# Altium schematic sheet 0175_virtual battery.SchDoc
size A3
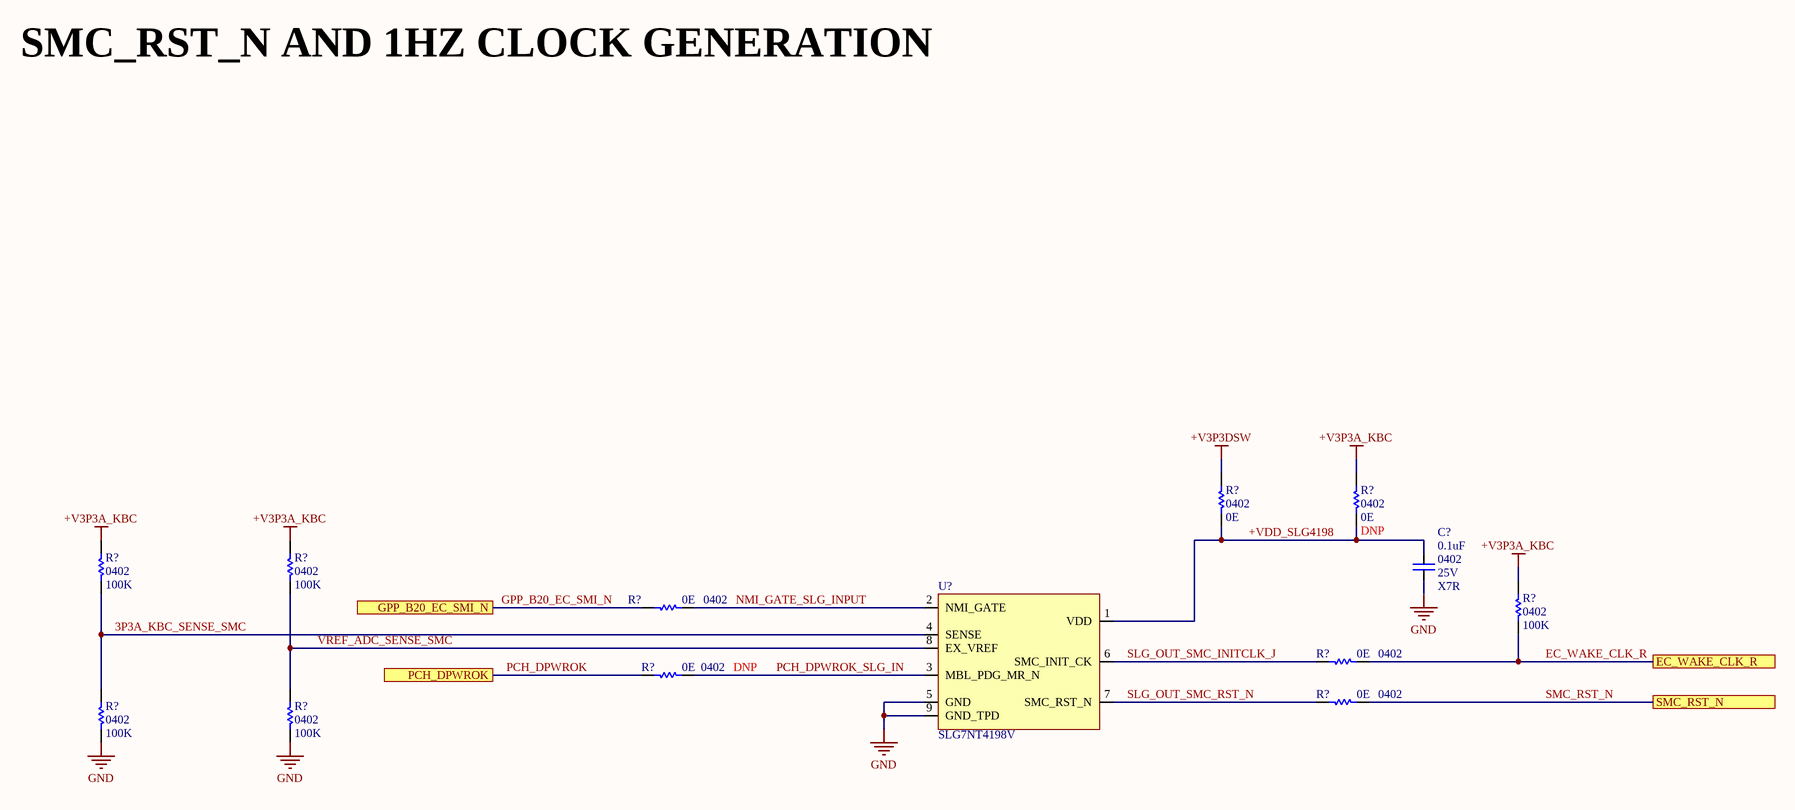
[diagram p0: 0175_virtual battery.SchDoc]

## Parts
(Parts that share a designator on the sheet are numbered #1, #2 ... from top to bottom, then left to right.)
C?  value 0.1uF  Case/Package: 0402  Voltage: 25V  Dielectric: X7R  [CAPC0402]
R?#1  value 0E  Case/Package: 0402  [RESC0402]  (hidden comment: Res)
R?#2  value 0E  Case/Package: 0402  [RESC0402]  (hidden comment: Res)
R?#3  value 100K  Case/Package: 0402  [RESC0402]  (hidden comment: Res)
R?#4  value 100K  Case/Package: 0402  [RESC0402]  (hidden comment: Res)
R?#5  value 0E  Case/Package: 0402  [RESC0402]  (hidden comment: Res)
R?#6  value 100K  Case/Package: 0402  [RESC0402]  (hidden comment: Res)
R?#7  value 0E  Case/Package: 0402  [RESC0402]  (hidden comment: Res)
R?#8  value 0E  Case/Package: 0402  [RESC0402]  (hidden comment: Res)
R?#9  value 0E  Case/Package: 0402  [RESC0402]  (hidden comment: Res)
R?#10  value 100K  Case/Package: 0402  [RESC0402]  (hidden comment: Res)
R?#11  value 100K  Case/Package: 0402  [RESC0402]  (hidden comment: Res)
U?  SLG7NT4198V

## Ports
EC_WAKE_CLK_R, GPP_B20_EC_SMI_N, PCH_DPWROK, SMC_RST_N

## Nets
+V3P3A_KBC: R?#2.1 R?#3.2 R?#4.2 R?#6.1
+V3P3DSW: R?#1.1
GND: C?.1 R?#10.1 R?#11.1 U?.5(GND) U?.9(GND_TPD)
3P3A_KBC_SENSE_SMC: R?#3.1 R?#10.2 U?.4(SENSE)
+VDD_SLG4198: C?.2 R?#1.2 R?#2.2 U?.1(VDD)
EC_WAKE_CLK_R: R?#6.2 R?#7.2 ; port EC_WAKE_CLK_R
GPP_B20_EC_SMI_N: R?#5.2 ; port GPP_B20_EC_SMI_N
NMI_GATE_SLG_INPUT: R?#5.1 U?.2(NMI_GATE)
PCH_DPWROK: R?#8.2 ; port PCH_DPWROK
PCH_DPWROK_SLG_IN: R?#8.1 U?.3(MBL_PDG_MR_N)
SLG_OUT_SMC_INITCLK_J: R?#7.1 U?.6(SMC_INIT_CK)
SLG_OUT_SMC_RST_N: R?#9.1 U?.7(SMC_RST_N)
SMC_RST_N: R?#9.2 ; port SMC_RST_N
VREF_ADC_SENSE_SMC: R?#4.1 R?#11.2 U?.8(EX_VREF)

## Notes on the sheet
- SMC_RST_N AND 1HZ CLOCK GENERATION

## Library data of the parts
C? = Cap: CAP CER 0.1uF 25V X7R 0402
R?#1 R?#2 R?#5 R?#7-R?#9 = Res: Thick Film Resistor -  0ohm, 1%,0402
  R?#2 R?#8: DNP: DNP
R?#3 R?#4 R?#6 R?#10 R?#11 = Res: Thick Film Resistor -  100Kohm, 1%,0402